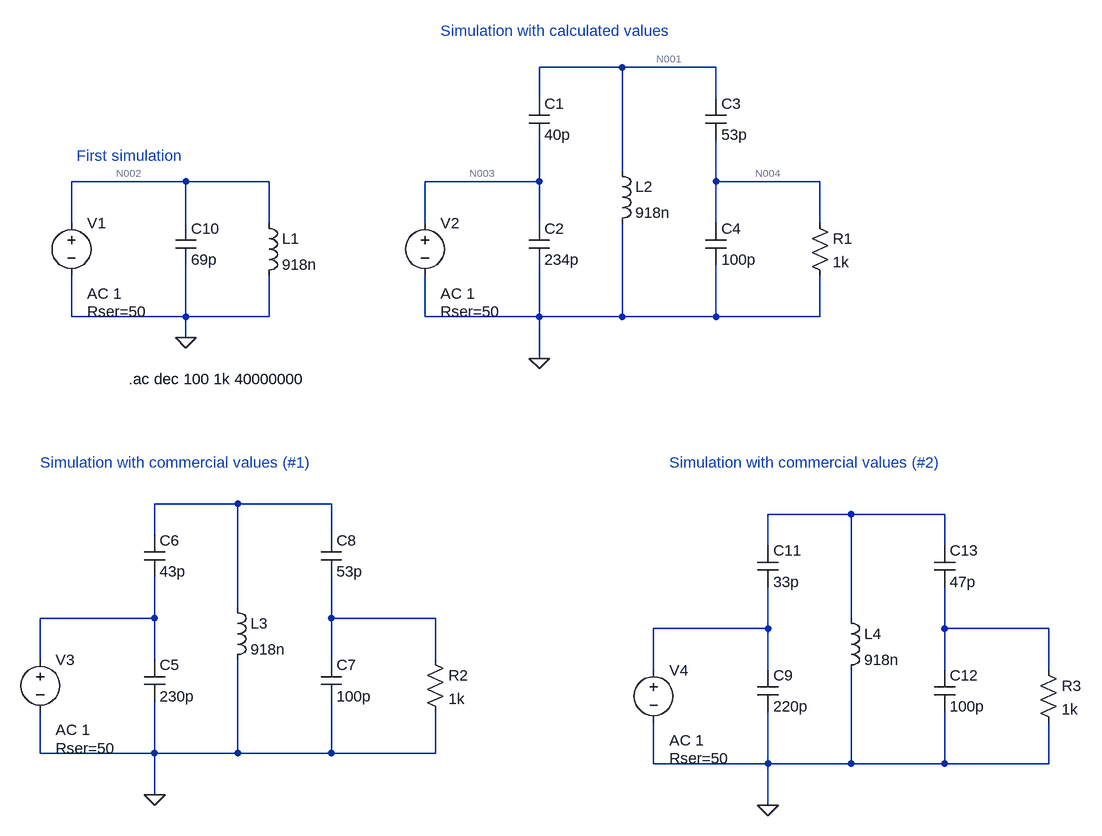
[diagram p0: schematic Circuito resonante 1.asc]
Circuito resonante 1.asc, the LTspice schematic file:
Version 4
SHEET 1 1208 788
WIRE 48 -368 -80 -368
WIRE 192 -368 48 -368
WIRE -80 -320 -80 -368
WIRE 192 -320 192 -368
WIRE 48 -208 48 -368
WIRE -624 -192 -800 -192
WIRE -496 -192 -624 -192
WIRE -80 -192 -80 -256
WIRE -80 -192 -256 -192
WIRE 192 -192 192 -256
WIRE 352 -192 192 -192
WIRE -800 -128 -800 -192
WIRE -624 -128 -624 -192
WIRE -496 -128 -496 -192
WIRE -256 -128 -256 -192
WIRE -80 -128 -80 -192
WIRE 192 -128 192 -192
WIRE 352 -128 352 -192
WIRE -800 16 -800 -48
WIRE -624 16 -624 -64
WIRE -624 16 -800 16
WIRE -496 16 -496 -48
WIRE -496 16 -624 16
WIRE -256 16 -256 -48
WIRE -80 16 -80 -64
WIRE -80 16 -256 16
WIRE 48 16 48 -128
WIRE 48 16 -80 16
WIRE 192 16 192 -64
WIRE 192 16 48 16
WIRE 352 16 352 -48
WIRE 352 16 192 16
WIRE -624 48 -624 16
WIRE -80 80 -80 16
WIRE -544 304 -672 304
WIRE -400 304 -544 304
WIRE 400 320 272 320
WIRE 544 320 400 320
WIRE -672 352 -672 304
WIRE -400 352 -400 304
WIRE 272 368 272 320
WIRE 544 368 544 320
WIRE -544 464 -544 304
WIRE -672 480 -672 416
WIRE -672 480 -848 480
WIRE -400 480 -400 416
WIRE -240 480 -400 480
WIRE 400 480 400 320
WIRE 272 496 272 432
WIRE 272 496 96 496
WIRE 544 496 544 432
WIRE 704 496 544 496
WIRE -848 544 -848 480
WIRE -672 544 -672 480
WIRE -400 544 -400 480
WIRE -240 544 -240 480
WIRE 96 560 96 496
WIRE 272 560 272 496
WIRE 544 560 544 496
WIRE 704 560 704 496
WIRE -848 688 -848 624
WIRE -672 688 -672 608
WIRE -672 688 -848 688
WIRE -544 688 -544 544
WIRE -544 688 -672 688
WIRE -400 688 -400 608
WIRE -400 688 -544 688
WIRE -240 688 -240 624
WIRE -240 688 -400 688
WIRE 96 704 96 640
WIRE 272 704 272 624
WIRE 272 704 96 704
WIRE 400 704 400 560
WIRE 400 704 272 704
WIRE 544 704 544 624
WIRE 544 704 400 704
WIRE 704 704 704 640
WIRE 704 704 544 704
WIRE -672 752 -672 688
WIRE 272 768 272 704
FLAG -624 48 0
FLAG -80 80 0
FLAG -672 752 0
FLAG 272 768 0
SYMBOL voltage -800 -144 R0
WINDOW 123 24 124 Left 2
WINDOW 39 24 152 Left 2
SYMATTR Value2 AC 1
SYMATTR SpiceLine Rser=50
SYMATTR InstName V1
SYMATTR Value ""
SYMBOL cap -640 -128 R0
SYMATTR InstName C10
SYMATTR Value 69p
SYMBOL ind -512 -144 R0
SYMATTR InstName L1
SYMATTR Value 918n
SYMBOL voltage -256 -144 R0
WINDOW 123 24 124 Left 2
WINDOW 39 24 152 Left 2
SYMATTR Value2 AC 1
SYMATTR SpiceLine Rser=50
SYMATTR InstName V2
SYMATTR Value ""
SYMBOL cap -96 -128 R0
SYMATTR InstName C2
SYMATTR Value 234p
SYMBOL ind 32 -224 R0
SYMATTR InstName L2
SYMATTR Value 918n
SYMBOL cap -96 -320 R0
SYMATTR InstName C1
SYMATTR Value 40p
SYMBOL cap 176 -128 R0
SYMATTR InstName C4
SYMATTR Value 100p
SYMBOL cap 176 -320 R0
SYMATTR InstName C3
SYMATTR Value 53p
SYMBOL res 336 -144 R0
SYMATTR InstName R1
SYMATTR Value 1k
SYMBOL voltage -848 528 R0
WINDOW 123 24 124 Left 2
WINDOW 39 24 152 Left 2
SYMATTR Value2 AC 1
SYMATTR SpiceLine Rser=50
SYMATTR InstName V3
SYMATTR Value ""
SYMBOL cap -688 544 R0
SYMATTR InstName C5
SYMATTR Value 230p
SYMBOL ind -560 448 R0
SYMATTR InstName L3
SYMATTR Value 918n
SYMBOL cap -688 352 R0
SYMATTR InstName C6
SYMATTR Value 43p
SYMBOL cap -416 544 R0
SYMATTR InstName C7
SYMATTR Value 100p
SYMBOL cap -416 352 R0
SYMATTR InstName C8
SYMATTR Value 53p
SYMBOL res -256 528 R0
SYMATTR InstName R2
SYMATTR Value 1k
SYMBOL voltage 96 544 R0
WINDOW 123 24 124 Left 2
WINDOW 39 24 152 Left 2
SYMATTR Value2 AC 1
SYMATTR SpiceLine Rser=50
SYMATTR InstName V4
SYMATTR Value ""
SYMBOL cap 256 560 R0
SYMATTR InstName C9
SYMATTR Value 220p
SYMBOL ind 384 464 R0
SYMATTR InstName L4
SYMATTR Value 918n
SYMBOL cap 256 368 R0
SYMATTR InstName C11
SYMATTR Value 33p
SYMBOL cap 528 560 R0
SYMATTR InstName C12
SYMATTR Value 100p
SYMBOL cap 528 368 R0
SYMATTR InstName C13
SYMATTR Value 47p
SYMBOL res 688 544 R0
SYMATTR InstName R3
SYMATTR Value 1k
TEXT -712 112 Left 2 !.ac dec 100 1k 40000000
TEXT -792 -232 Left 2 ;First simulation
TEXT -232 -424 Left 2 ;Simulation with calculated values
TEXT -848 240 Left 2 ;Simulation with commercial values (#1)
TEXT 120 240 Left 2 ;Simulation with commercial values (#2)

The netlist it stands for:
* Circuito resonante 1.asc
V1 N002 0 AC 1 Rser=50
C10 N002 0 69p
L1 N002 0 918n
V2 N003 0 AC 1 Rser=50
C2 N003 0 234p
L2 N001 0 918n
C1 N001 N003 40p
C4 N004 0 100p
C3 N001 N004 53p
R1 N004 0 1k
V3 N007 0 AC 1 Rser=50
C5 N007 0 230p
L3 N005 0 918n
C6 N005 N007 43p
C7 N008 0 100p
C8 N005 N008 53p
R2 N008 0 1k
V4 N009 0 AC 1 Rser=50
C9 N009 0 220p
L4 N006 0 918n
C11 N006 N009 33p
C12 N010 0 100p
C13 N006 N010 47p
R3 N010 0 1k
.ac dec 100 1k 40000000
* First simulation
* Simulation with calculated values
* Simulation with commercial values (#1)
* Simulation with commercial values (#2)
.backanno
.end

* Results of the author's LTspice run, read from the files saved beside the schematic
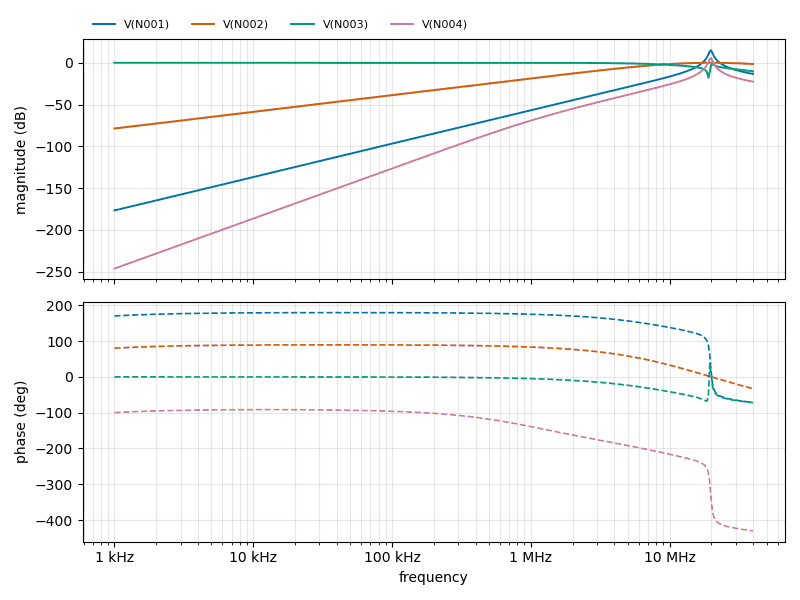
[diagram p1: AC Analysis of Circuito resonante 1.asc, plotted from the saved traces]
* AC Analysis, 1 run:
*   V(N001): -176.65 dB at 1 kHz, -13.38 dB at 40 MHz, peak 14.85 dB at 19.95 MHz, 3 dB below the peak at 19.27 MHz and 20.35 MHz
*   V(N002): -78.63 dB at 1 kHz, -1.53 dB at 40 MHz, peak -0.00 dB at 19.95 MHz, 3 dB below the peak at 7.462 MHz
*   V(N003): -0.00 dB at 1 kHz, -10.24 dB at 40 MHz, peak -0.00 dB at 1 kHz, 3 dB below the peak at 11.17 MHz
*   V(N004): -246.20 dB at 1 kHz, -22.59 dB at 40 MHz, peak 5.63 dB at 19.95 MHz, 3 dB below the peak at 19.27 MHz and 20.35 MHz